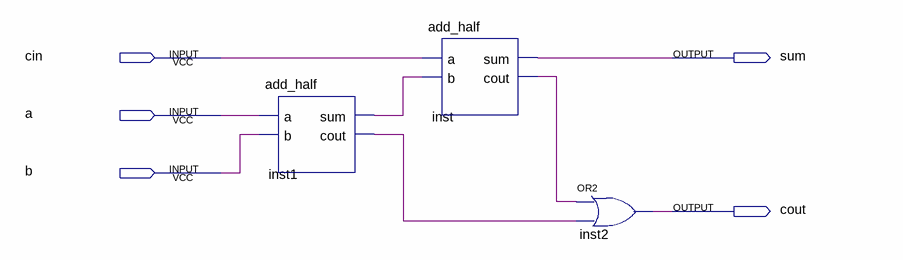
[diagram p0: schematic sheet]
// Quartus schematic add_full.bdf as structural Verilog: 3 symbols, 5 pins
module add_full (
  input  cin,
  input  a,
  input  b,
  output sum,
  output cout
);

  wire inst1_cout, inst1_sum, inst_cout;

  add_half inst1 (.a(a), .b(b), .sum(inst1_sum), .cout(inst1_cout));
  add_half inst (.a(cin), .b(inst1_sum), .sum(sum), .cout(inst_cout));
  or inst2 (cout, inst_cout, inst1_cout);
endmodule
